# Altium schematic sheet Power.SchDoc
size A4; Organization: Altium Limited; Address1: L3, 12a Rodborough Rd; Address2: Frenchs Forest; Address3: NSW; Address4: Australia 2086
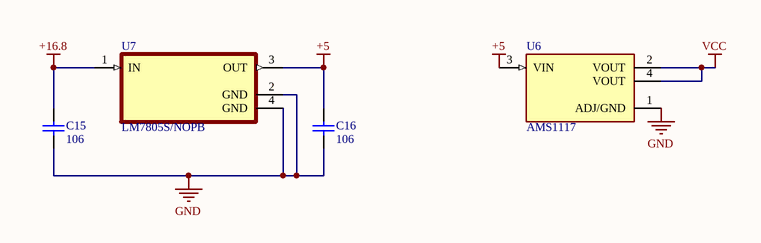
[diagram p0: Power.SchDoc]

## Parts
C15  106  [tu 0603]
C16  106  [tu 0603]
U6  AMS1117  [SOT229P700X180-4N]
U7  LM7805S/NOPB  [TO254P1524X483-4N]

## Nets
+5: C16.1 U6.3(VIN) U7.3(OUT)
+16.8: C15.1 U7.1(IN)
GND: C15.2 C16.2 U6.1(ADJ/GND) U7.2(GND) U7.4(GND)
VCC: U6.2(VOUT) U6.4(VOUT)

## Notes on the sheet
- Title
- Size:
- Date:
- A4
- Number:
- Time:
- Revision:
- Sheet
- of
- File:

## Library data of the parts
C15 C16 = Tu 0603 106 16V 20%: Dán; Don_Vi: Con; So_Chan: 2; Ten_Linh_Kien: Tụ 0603-10uF 20% 16V; Ma_Hang: MH004848; Chung_Loai: Dán; Kieu_Chan: *
U6 = AMS1117: 1A LOW DROPOUT VOLTAGE REGULATOR SOT-223; MF: Advanced Monolithic Systems; Price: None; Availability: Not in stock; Package: SOT-223 Seeed Technology; MP: AMS1117; Value: *; SnapEDA_Link: https://www.snapeda.com/parts/AMS1117/Advanced+Monolithic+Systems/view-part/?ref=snap; Check_prices: https://www.snapeda.com/parts/AMS1117/Advanced+Monolithic+Systems/view-part/?ref=eda
U7 = LM7805S/NOPB: 1.5-A, 30-V, linear voltage regulator; MF: Texas Instruments; Check_prices: https://www.snapeda.com/parts/LM7805S/NOPB/Texas+Instruments/view-part/?ref=eda; Value: *; Availability: In Stock; MP: LM7805S/NOPB; Price: None; Package: TO-263-3 Texas Instruments; SnapEDA_Link: https://www.snapeda.com/parts/LM7805S/NOPB/Texas+Instruments/view-part/?ref=snap; Purchase-URL: https://pricing.snapeda.com/search/part/LM7805S/NOPB/?ref=eda